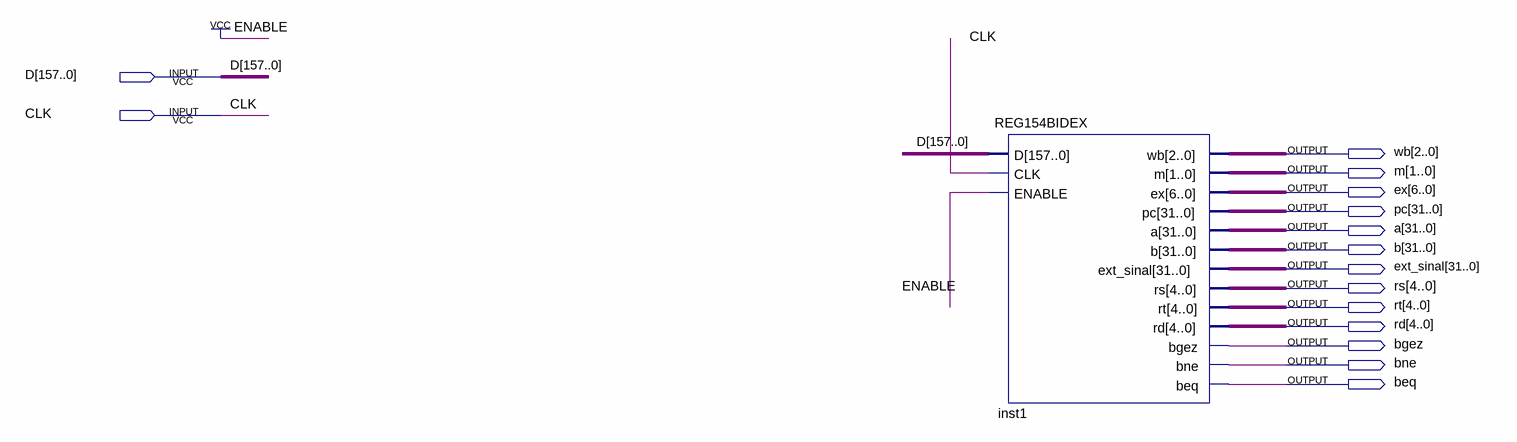
[diagram p0: schematic sheet]
// Quartus schematic ID-EX.bdf as structural Verilog: 1 symbols, 15 pins
module \ID-EX  (
  input  [157:0] D,
  input  CLK,
  output [2:0] wb,
  output [1:0] m,
  output [6:0] ex,
  output [31:0] pc,
  output [31:0] a,
  output [31:0] b,
  output [31:0] ext_sinal,
  output [4:0] rs,
  output [4:0] rt,
  output [4:0] rd,
  output bgez,
  output bne,
  output beq
);

  REG154BIDEX inst1 (
    .D(D), .CLK(CLK), .ENABLE(1'b1), .wb(wb), .m(m), .ex(ex), .pc(pc), .a(a), .b(b), .ext_sinal(ext_sinal),
    .rs(rs), .rt(rt), .rd(rd), .bgez(bgez), .bne(bne), .beq(beq));
endmodule
